# Altium schematic sheet MKRZero_V5.0_0.SchDoc: MKRZero_V5.0
size 409 x 289 mm; Origin: Eagle; Date: 2023-03-06 22:57:54; SheetNumber: 1; CODE-ARDUINO: DNP; DATASHEET: DNP; DISTRIBUTOR-LINK: DNP; DISTRIBUTOR-PN: DNP; MANUFACTURER: DNP; MANUFACTURER-PN: DNP; NOTE: DNP; Value: DNP; GateName_1: G$1; SymbolName_1: A3L-LOC; LibraryName: Arduino-utility; DeviceSetName: A3-FRAME; Sheet: Sheet:; ReferenceDesignsAREPROVIDED"ASIS"AND"WITHALLFAULTS.ArduinoSADISCLAIMSALLOTHERWARRANTIES,EXPRESSORIMPLIED,
REGARDINGPRODUCTS,INCLUDINGBUTNOTLIMITEDTO,ANYIMPLIEDWARRANTIESOFMERCHANTABILITYORFITNESSFORAPARTICULARPURPOSE

ArduinoSAmaymakechangestospecificationsandproductdescriptionsatanytime,withoutnotice.TheCustomermustnot
relyontheabsenceorcharacteristicsofanyfeaturesorinstructionsmarked"reserved"or"undefined."ArduinoSAreserves
theseforfuturedefinitionandshallhavenoresponsibilitywhatsoeverforconflictsorincompatibilitiesarisingfromfuturechangestothem.
TheproductinformationontheWebSiteorMaterialsissubjecttochangewithoutnotice.Donotfinalizeadesignwiththisinfo

ARDUINOandotherArduinobrandsandlogosandTrademarksofArduinoSA.AllArduinoSATrademarkscannotbeusedwithoutowner'sformalpermission: Reference Designs ARE PROVIDED "AS IS" AND "WITH ALL FAULTS. Arduino SA DISCLAIMS ALL OTHER WARRANTIES, EXPRESS OR IMPLIED, / REGARDING PRODUCTS, INCLUDING BUT NOT LIMITED TO, ANY IMPLIED WARRANTIES OF MERCHANTABILITY OR FITNESS FOR A PARTICULAR PURPOSE / Arduino SA may make changes to specifications and product descriptions at any time, without notice. The Customer must not / rely on the absence or characteristics of any features or instructions marked "reserved" or "undefined." Arduino SA reserves / these for future definition and shall have no responsibility whatsoever for conflicts or incompatibilities arising from future changes to them. / The product information on the Web Site or Materials is subject to change without notice. Do not finalize a design with this info / ARDUINO and other Arduino brands and logos and Trademarks of Arduino SA. All Arduino SA Trademarks cannot be used without owner's formal permission
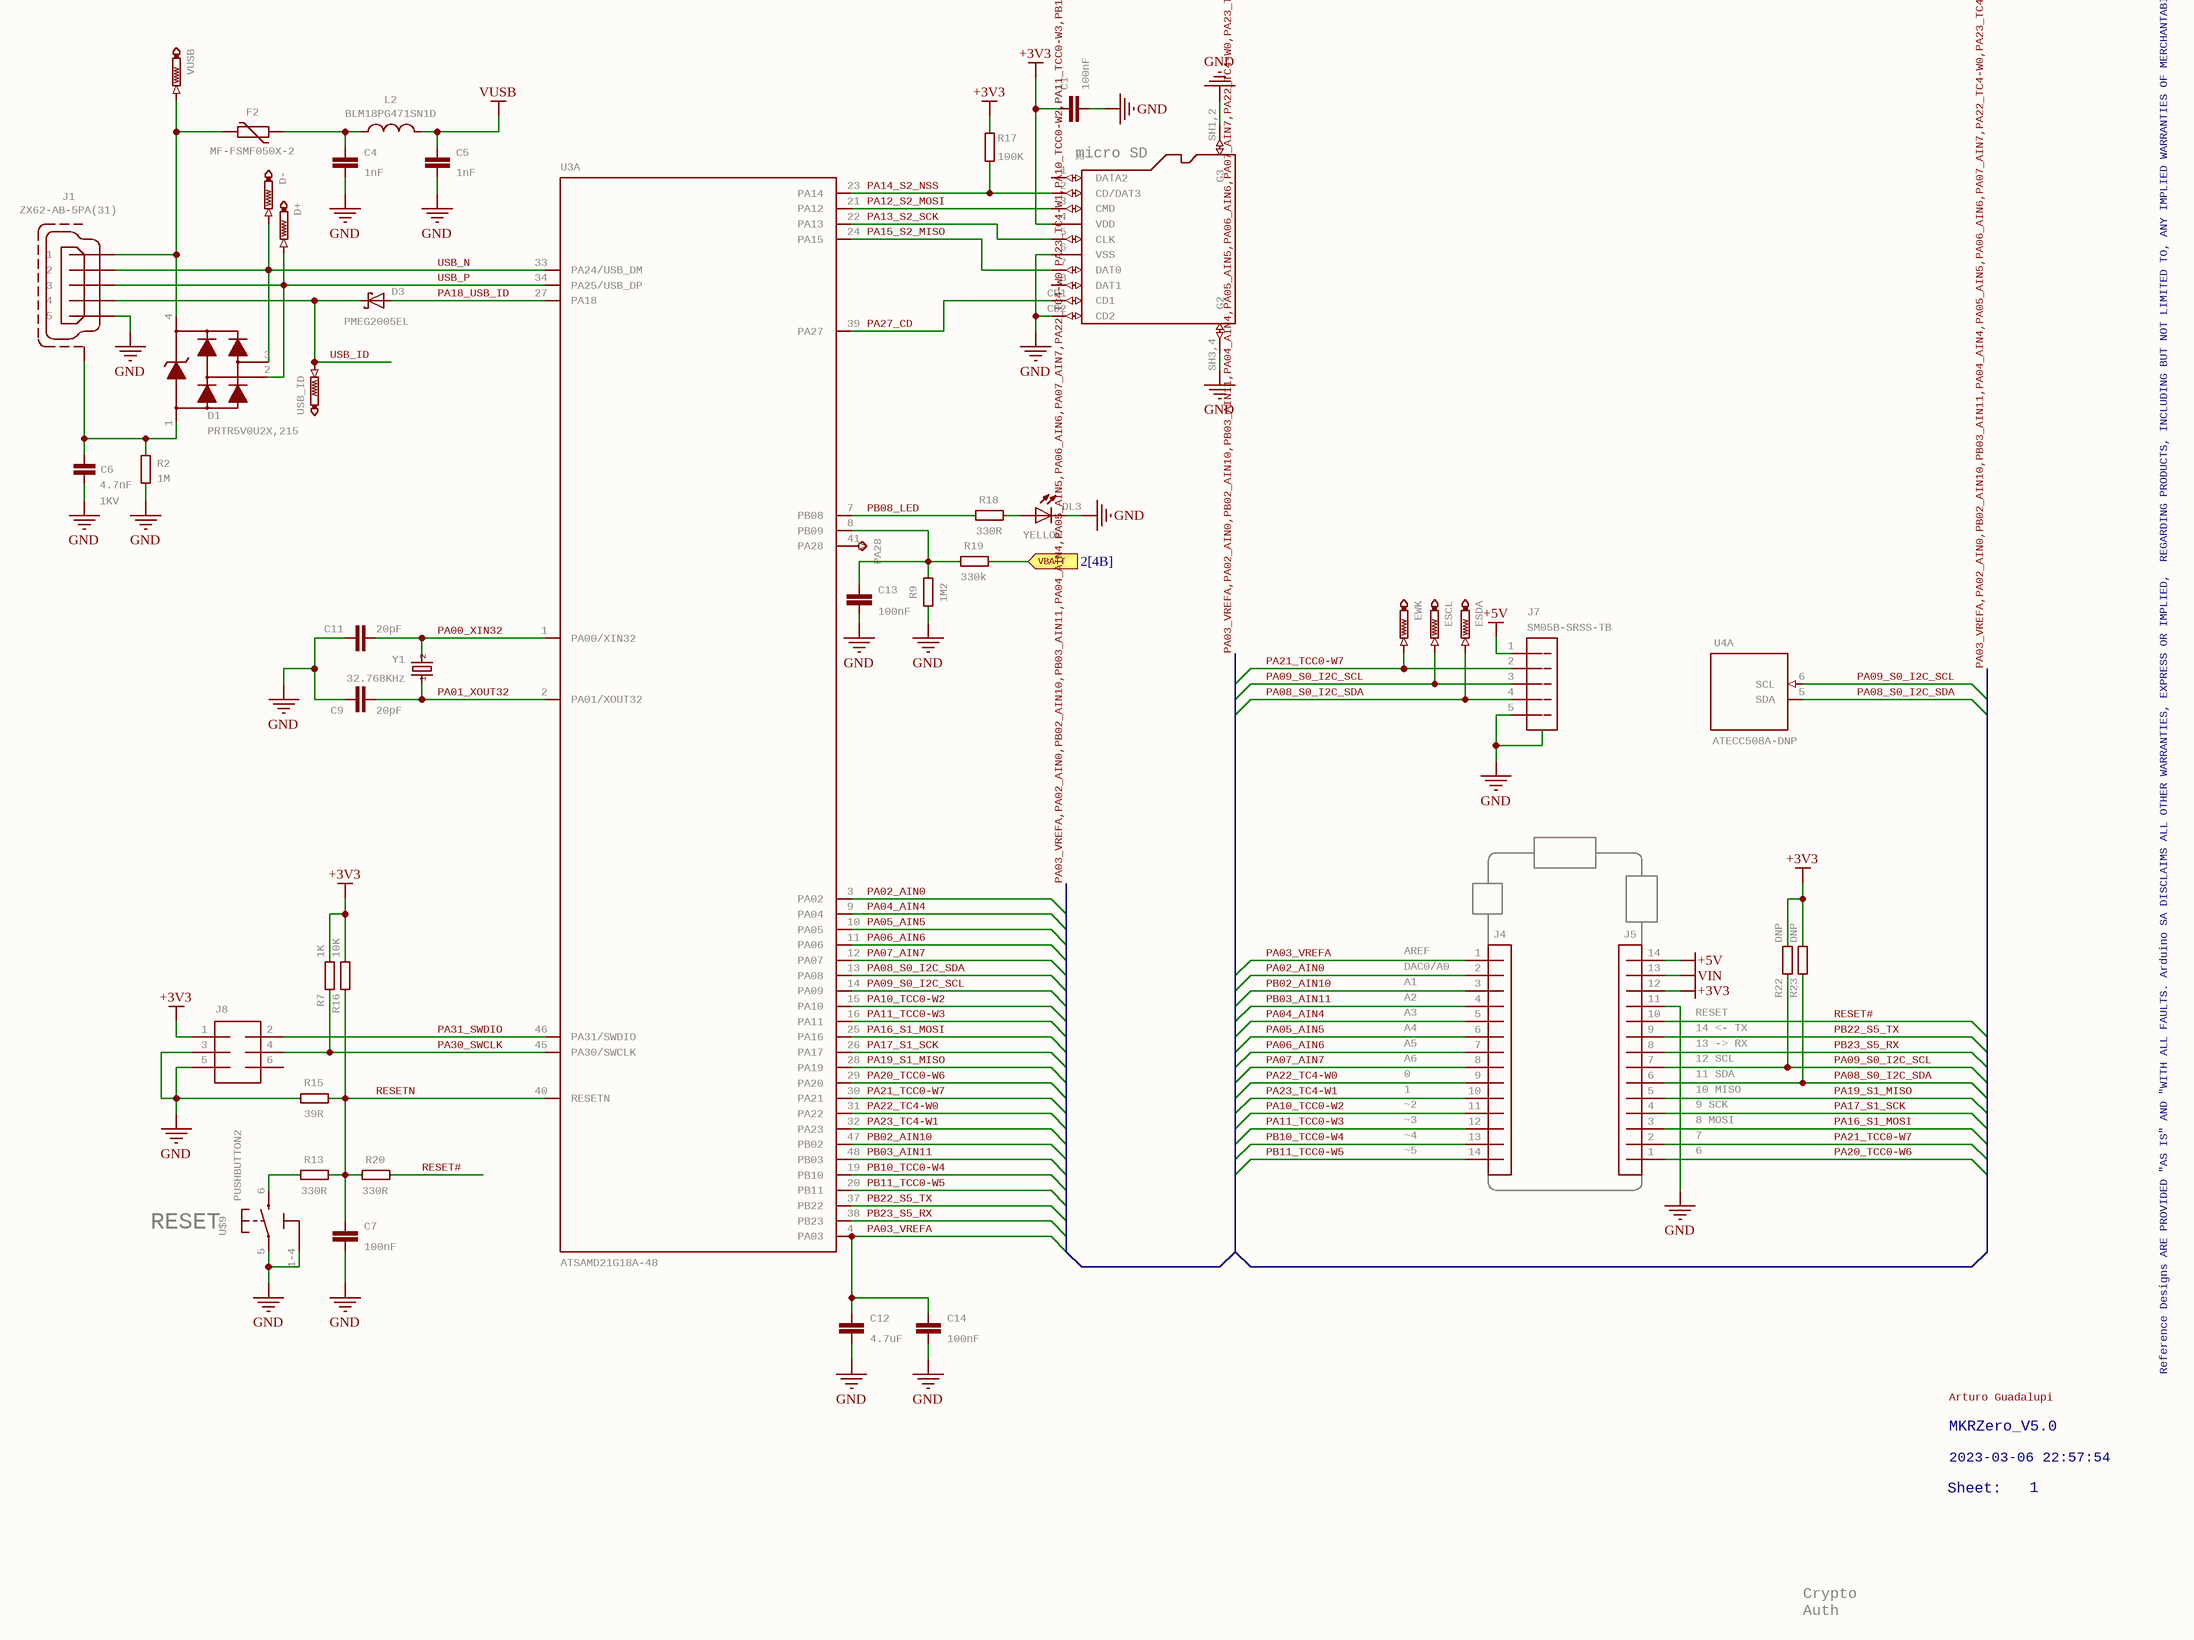
[diagram p0: MKRZero_V5.0_0.SchDoc]

## Parts
C1  100nF  [0402-1005X55N]
C4  1nF  [0402-1005X55N]
C5  1nF  [0402-1005X55N]
C6  4.7nF  VOLTAGE: 1KV  [C0805]
C7  100nF  [0402-1005X55N]
C9  20pF  [0402-1005X55N]
C11  20pF  [0402-1005X55N]
C12  4.7uF  [0402-1005X55N]
C13  100nF  [0402-1005X55N]
C14  100nF  [0402-1005X55N]
D1  PRTR5V0U2X,215  [SOT190P230X110-4N]
D3  PMEG2005EL  [SODFL1008X40N-882D]
D+  PTR1B1,27  [B1,27]  (value not drawn)
D-  PTR1B1,27  [B1,27]  (value not drawn)
DL3  YELLOW  [LEDC1608X80N-AK]
ESCL  PTR1B1,27  [B1,27]  (value not drawn)
ESDA  PTR1B1,27  [B1,27]  (value not drawn)
EWK  PTR1B1,27  [B1,27]  (value not drawn)
F2  MF-FSMF050X-2  [0603-F1608X100N]
J1  ZX62-AB-5PA(31)  [USBMICRO-ZX62-AB-5PA]
J3  AMPHENOL_114-00841-68  [AMPHENOL_114-00841-68]  (value not drawn)
J4  DNP  [STRIP-14-MODULI-A11]  (value not drawn)
J5  DNP  [STRIP-14-MODULI-A11]  (value not drawn)
J7  SM05B-SRSS-TB  [SM05B-SRSS-TB]
J8  2X3_SMD_MALE  [2X3_SMT]  (value not drawn)
L2  BLM18PG471SN1D  [0603-1608X90N]
PA28  TPB2,54  [B2,54]  (value not drawn)
R2  1M  [0402-1005X55N]
R7  1K  [0402-1005X55N]
R9  1M2  [0402-1005X55N]
R13  330R  [0402-1005X55N]
R15  39R  [0402-1005X55N]
R16  10K  [0402-1005X55N]
R17  100K  [0402-1005X55N]
R18  330R  [0402-1005X55N]
R19  330k  [0402-1005X55N]
R20  330R  [0402-1005X55N]
R22  DNP  [0402-1005X55N]
R23  DNP  [0402-1005X55N]
U3  ATSAMD21G18A-48  [QFN50P700X700X90-49XN-EPSQ515]  (part A of 2)
U4  ATECC508A-DNP  [SON50P300X200X60-9N-EP160X140]  (part A of 2)
U$9  PUSHBUTTON2  [C&K_PTS820_NOPEGS]
USB_ID  PTR1B1,27  [B1,27]  (value not drawn)
VUSB  PTR1B1,27  [B1,27]  (value not drawn)
Y1  32.768KHz  [QUARZO-ABS07]

## Ports
VBATT (in, see 2[4B])

## Nets
+3V3: C1.1 J3.4(VDD) J5.12 J8.1 R7.2 R16.2 R17.2 R22.2 R23.2
+5V: J5.14 J7.1
GND: C1.2 C4.2 C5.2 C6.2 C7.2 C9.1 C11.1 C12.2 C13.2 C14.2 DL3.C J1.5 J3.6(VSS) J3.CD2 J3.SH1,2(G3) J3.SH3,4(G2) J5.11 J7.5 J7.SH1,2(SH) J8.3 J8.5 R2.1 R9.1 R15.1 U$9.1-4 U$9.5
VIN: J5.13
VUSB: C5.1 L2.2
PA00_XIN32: C11.2 U3.1(PA00/XIN32) Y1.2
PA01_XOUT32: C9.2 U3.2(PA01/XOUT32) Y1.1
PA02_AIN0: J4.2 U3.3(PA02)
PA03_VREFA: C12.1 C14.1 J4.1 U3.4(PA03)
PA04_AIN4: J4.5 U3.9(PA04)
PA05_AIN5: J4.6 U3.10(PA05)
PA06_AIN6: J4.7 U3.11(PA06)
PA07_AIN7: J4.8 U3.12(PA07)
PA08_S0_I2C_SDA: ESDA.PP(TP) J5.6 J7.4 R23.1 U3.13(PA08) U4.5(SDA)
PA09_S0_I2C_SCL: ESCL.PP(TP) J5.7 J7.3 R22.1 U3.14(PA09) U4.6(SCL)
PA10_TCC0-W2: J4.11 U3.15(PA10)
PA11_TCC0-W3: J4.12 U3.16(PA11)
PA12_S2_MOSI: J3.3(CMD) U3.21(PA12)
PA13_S2_SCK: J3.5(CLK) U3.22(PA13)
PA14_S2_NSS: J3.2(CD/DAT3) R17.1 U3.23(PA14)
PA15_S2_MISO: J3.7(DAT0) U3.24(PA15)
PA16_S1_MOSI: J5.3 U3.25(PA16)
PA17_S1_SCK: J5.4 U3.26(PA17)
PA18_USB_ID: D3.A U3.27(PA18)
PA19_S1_MISO: J5.5 U3.28(PA19)
PA20_TCC0-W6: J5.1 U3.29(PA20)
PA21_TCC0-W7: EWK.PP(TP) J5.2 J7.2 U3.30(PA21)
PA22_TC4-W0: J4.9 U3.31(PA22)
PA23_TC4-W1: J4.10 U3.32(PA23)
PA27_CD: J3.CD1 U3.39(PA27)
PA30_SWCLK: J8.4 R7.1 U3.45(PA30/SWCLK)
PA31_SWDIO: J8.2 U3.46(PA31/SWDIO)
PB02_AIN10: J4.3 U3.47(PB02)
PB03_AIN11: J4.4 U3.48(PB03)
PB08_LED: R18.1 U3.7(PB08)
PB10_TCC0-W4: J4.13 U3.19(PB10)
PB11_TCC0-W5: J4.14 U3.20(PB11)
PB22_S5_TX: J5.9 U3.37(PB22)
PB23_S5_RX: J5.8 U3.38(PB23)
RESET#: J5.10 R20.2
RESETN: C7.1 R13.2 R15.2 R16.1 R20.1 U3.40(RESETN)
USB_ID: D3.C J1.4 USB_ID.PP(TP)
USB_N: D1.3 D-.PP(TP) J1.2 U3.33(PA24/USB_DM)
USB_P: D1.2 D+.PP(TP) J1.3 U3.34(PA25/USB_DP)
VBATT: R19.2 ; port VBATT
NetC4_1: C4.1 F2.1 L2.1
NetC6_1: C6.1 D1.1 J1.6-11(SH) R2.2
NetC13_1: C13.1 R9.2 R19.1 U3.8(PB09)
NetD1_4: D1.4 F2.2 J1.1 VUSB.PP(TP)
NetDL3_A: DL3.A R18.2
NetPA28_PP: PA28.PP(TP) U3.41(PA28)
NetR13_1: R13.1 U$9.6

Not connected (* = marked no-connect by the designer): J3 1(DATA2) 8(DAT1); J8 6

## Buses and harness runs
bus PA03_VREFA,PA02_AIN0,PB02_AIN10,PB03_AIN11,PA04_AIN4,PA05_AIN5,PA06_AIN6,PA07_AIN7,PA22_TC4-W0,PA23_TC4-W1,PA10_TCC0-W2,PA11_TCC0-W3,PB10_TCC0-W4,PB11_TCC0-W5,PA20_TCC0-W6,PA21_TCC0-W7,PA16_S1_MOSI,PA17_S1_SCK,PA19_S1_MISO,PA08_S0_I2C_SDA,PA09_S0_I2C_SCL,PB23_S5_RX,PB22_S5_TX,RESET#

## Notes on the sheet
- (near J3) micro SD
- AREF
- (near J4) DAC0/A0
- A1
- A2
- A3
- A4
- A5
- A6
- 14 <- TX
- 13 -> RX
- 12 SCL
- RESET
- 0
- 1
- ~2
- ~3
- ~4
- 11 SDA
- 7
- 8 MOSI
- 9 SCK
- 10 MISO
- (near U$9) RESET
- ~5
- 6
- Reference Designs ARE PROVIDED "AS IS" AND "WITH ALL FAULTS. Arduino SA DISCLAIMS ALL OTHER WARRANTIES, EXPRESS OR IMPLIED,
  REGARDING PRODUCTS, INCLUDING BUT NOT LIMITED TO, ANY IMPLIED WARRANTIES OF MERCHANTABILITY OR FITNESS FOR A PARTICULAR PURPOSE
  Arduino SA may make changes to specifications and product descriptions at any time, without notice. The Customer must not
  rely on the absence or characteristics of any features or instructions marked "reserved" or "undefined." Arduino SA reserves
  these for future definition and shall have no responsibility whatsoever for conflicts or incompatibilities arising from future changes to them.
  The product information on the Web Site or Materials is subject to change without notice. Do not finalize a design with this info
  ARDUINO and other Arduino brands and logos and Trademarks of Arduino SA. All Arduino SA Trademarks cannot be used without owner's formal permission
- Arturo Guadalupi
- MKRZero_V5.0
- Sheet:
- 2023-03-06 22:57:54
- Crypto
  Auth

## Library data of the parts
C1 C5 C7 C13 C14 = C-0402: Capacitor; MPN: C1005X5R1H104K050BB; GateName_1: G$1; SymbolName_1: C; DeviceName: -0402; DESCR: CAP CER 0.1UF 50V 10% X5R 0402; MF: TDK; LibraryName: MK1_Zero; DeviceSetName: C
C4 = C-0402: Capacitor; MPN: GRM155R71H103KA88J; GateName_1: G$1; SymbolName_1: C; DeviceName: -0402; DESCR: CAP CER 10NF 50V 10% X7R 0402; MF: Murata; LibraryName: MK1_Zero; DeviceSetName: C
C6 = CAPACITORS-0805: Capacitors ...4.7uF @ 6.3V -> 0402 ...10uF @ 16V -> 0603 ...22uF @ 25V -> 0805; GateName_1: C; DeviceName: -0805; SymbolName_1: CAPACITOR; LibraryName: Arduino-rcl; DeviceSetName: CAPACITORS
C9 C11 = C-0402: Capacitor; MPN: CBR04C200J5GAC; GateName_1: G$1; SymbolName_1: C; DeviceName: -0402; DESCR: CAP CER 20PF 50V 5% NP0 0402; MF: Kemet; LibraryName: MK1_Zero; DeviceSetName: C
C12 = C-0402: Capacitor; MPN: GRM155R60J475ME47D; GateName_1: G$1; SymbolName_1: C; DeviceName: -0402; DESCR: CAP CER 4.7UF 6.3V 20% X5R 0402; MF: Murata; LibraryName: MK1_Zero; DeviceSetName: C
D1 = PRTR5V0U2X,215: GateName_1: G$1; DESCR: TVS DIODE 5.5VWM SOT143B; MF: NXP; SymbolName_1: PRTR5V0U2X; LibraryName: MK1_Zero; DeviceSetName: PRTR5V0U2X,215; MPN: PRTR5V0U2X,215
D3 = PMEG2005EL: DIODE SCHOTTKY 20V 500MA SOD882; MPN: PMEG2005EL,315; GateName_1: G$1; MF: NXP; SymbolName_1: SCHOTTKY; LibraryName: MK1_Zero; DeviceSetName: PMEG2005EL; DESCR: DIODE SCHOTTKY 20V 500MA SOD882
D+ D- ESCL ESDA EWK USB_ID VUSB = PTR1B1,27: TEST PIN; GateName_1: G$1; SymbolName_1: PS; DeviceSetName: PTR1; DeviceName: B1,27; LibraryName: testpad
DL3 = LED-0603: LED; MPN: HSMG-C190; GateName_1: G$1; DeviceName: -0603; DESCR: LED GREEN DIFFUSED 0603 SMD; MF: Avago; SymbolName_1: LED; LibraryName: MK1_Zero; DeviceSetName: LED
F2 = MF-FSMF050X-2: FUSE PTC RESET 500MA SMD 0603; GateName_1: G$1; MF: Bourns Inc; SymbolName_1: PTC; LibraryName: MK1_Zero; DeviceSetName: MF-FSMF050X-2; DESCR: FUSE PTC RESET 500MA SMD 0603; MPN: MF-FSMF050X-2
J1 = ZX62AB-5PA(11): GateName_1: G$1; SymbolName_1: MICRO-USB; LibraryName: MK1_Zero; DeviceSetName: ZX62AB-5PA(11)
J3 = AMPHENOL_114-00841-68: GateName_1: G$1; SymbolName_1: MICRO-SD-CARD-HOLDER-10P; LibraryName: Arduino-connectors; DeviceSetName: AMPHENOL_114-00841-68
J4 J5 = STRIP-14: GateName_1: G$1; SymbolName_1: M14; LibraryName: MK1_Zero; DeviceSetName: STRIP-14
J7 = SM05B-SRSS-TB: CONN HEADER SH 5POS SIDE 1MM TIN   Datasheet; GateName_1: G$1; SymbolName_1: M05; MF: JST; LibraryName: MK1_Zero; DeviceSetName: SM05B-SRSS-TB; DESCR: CONN HEADER SH 5POS SIDE 1MM TIN; MPN: SM05B-SRSS-TB
J8 = 2X3_SMD_MALE: GateName_1: G$1; SymbolName_1: 3X02; LibraryName: MK1_Zero; DeviceSetName: 2X3_SMD_MALE
L2 = BLM18PG471SN1D: FERRITE CHIP 470 OHM 1000MA 0603; GateName_1: G$1; SymbolName_1: L; LibraryName: MK1_Zero; DeviceSetName: BLM18PG471SN1D
PA28 = TPB2,54: Test pad; GateName_1: G$1; SymbolName_1: TP; DeviceName: B2,54; LibraryName: testpad; DeviceSetName: TP
R2 = R-0402: Resistor; MPN: RC0402FR-071ML; GateName_1: G$1; SymbolName_1: R; DeviceName: -0402; DESCR: RES 1M OHM 1/16W 1% 0402; MF: Yageo; LibraryName: MK1_Zero; DeviceSetName: R
R7 = R-0402: Resistor; MPN: RC0402FR-071KL; GateName_1: G$1; SymbolName_1: R; DeviceName: -0402; DESCR: RES SMD 1K OHM 1% 1/16W 0402; MF: Yageo; LibraryName: MK1_Zero; DeviceSetName: R
R9 R13 R18-R20 = R-0402: Resistor; MPN: RC0402FR-07330RL; GateName_1: G$1; SymbolName_1: R; DeviceName: -0402; DESCR: RES 330 OHM 1/16W 1% 0402 SMD; MF: Yageo; LibraryName: MK1_Zero; DeviceSetName: R
R15 = R-0402: Resistor; MPN: RC0402FR-0739RL; GateName_1: G$1; SymbolName_1: R; DeviceName: -0402; DESCR: RES 39.0 OHM 1/16W 1% 0402 SMD; MF: Yageo; LibraryName: MK1_Zero; DeviceSetName: R
R16 = R-0402: Resistor; MPN: RC0402FR-0710KL; GateName_1: G$1; SymbolName_1: R; DeviceName: -0402; DESCR: RES SMD 10K OHM 1% 1/16W 0402; MF: Yageo; LibraryName: MK1_Zero; DeviceSetName: R
R17 = R-0402: Resistor; MPN: RC0402FR-07100KL; GateName_1: G$1; SymbolName_1: R; DeviceName: -0402; DESCR: RES 100K OHM 1/16W 1% 0402 SMD; MF: Yageo; LibraryName: MK1_Zero; DeviceSetName: R
R22 R23 = R-0402: Resistor; MPN: RC0402FR-074K7L; GateName_1: G$1; SymbolName_1: R; DeviceName: -0402; DESCR: RES 4.7K OHM 1/16W 1% 0402 SMD; MF: Yageo; LibraryName: MK1_Zero; DeviceSetName: R
U3 = ATSAMD21G18A-48: IC MCU 32BIT 256KB FLASH 48QFN   Datasheet (Summary) Datasheet (Complete); MPN: ATSAMD21E18A-MU; GateName_1: A; SymbolName_1: ATSAMD21G18A-48-A; GateName_2: B; SymbolName_2: ATSAMD21G18A-48-B; MF: Atmel; LibraryName: MK1_Zero; DeviceSetName: ATSAMD21G18A-48; DESCR: IC MCU 32BIT 256KB FLASH 48QFN
U4 = ATECC508A-MAHDA-T: IC CRYPTO ECC 8KB 8-UDFN I2C; GateName_1: A; SymbolName_1: ATECC508A-A; GateName_2: B; SymbolName_2: ATECC508A-B; MF: Atmel; LibraryName: MK1_Zero; DeviceSetName: ATECC508A-MAHDA-T; DESCR: IC CRYPTO ECC 8KB 8-UDFN I2C; MPN: ATECC508A-MAHDA-T
U$9 = PUSHBUTTON2: TS42 Dongnan Electronics Tact switch VDC 12V - 50mA; GateName_1: G$1; SymbolName_1: TACTILE; LibraryName: Arduino-pushbuttons; DeviceSetName: PUSHBUTTON2
Y1 = ABS07-32.768KHZ-T: GateName_1: G$1; SymbolName_1: Q; DESCR: CRYSTAL 32.768KHZ 12.5PF SMD 3.2x1.5mm; MF: Abracon; LibraryName: MK1_Zero; DeviceSetName: ABS07-32.768KHZ-T; 1: 1; 2: 2; MPN: ABS07-32.768KHZ-T